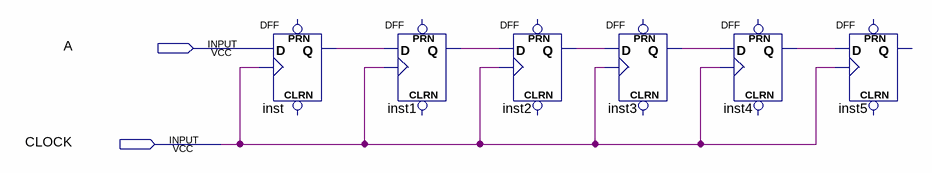
[diagram p0: schematic sheet]
// Quartus schematic Block1.bdf as structural Verilog: 6 symbols, 2 pins
module Block1 (
  input  A,
  input  CLOCK
);

  wire inst1_q, inst2_q, inst3_q, inst4_q, inst_q;

  DFF inst (.CLK(CLOCK), .D(A), .Q(inst_q));  // open: CLRN, PRN
  DFF inst1 (.CLK(CLOCK), .D(inst_q), .Q(inst1_q));  // open: CLRN, PRN
  DFF inst2 (.CLK(CLOCK), .D(inst1_q), .Q(inst2_q));  // open: CLRN, PRN
  DFF inst3 (.CLK(CLOCK), .D(inst2_q), .Q(inst3_q));  // open: CLRN, PRN
  DFF inst4 (.CLK(CLOCK), .D(inst3_q), .Q(inst4_q));  // open: CLRN, PRN
  DFF inst5 (.CLK(CLOCK), .D(inst4_q));  // open: CLRN, PRN, Q
endmodule
